# Altium schematic sheet I2C.SchDoc
size A4; CompanyName: TH Nürnberg; Organization: UltraZohm; Address1: Kesslerplatz 12; Address2: 90489 Nürnberg; Address3: GERMANY; SheetNumber: 9; SheetTotal: 10
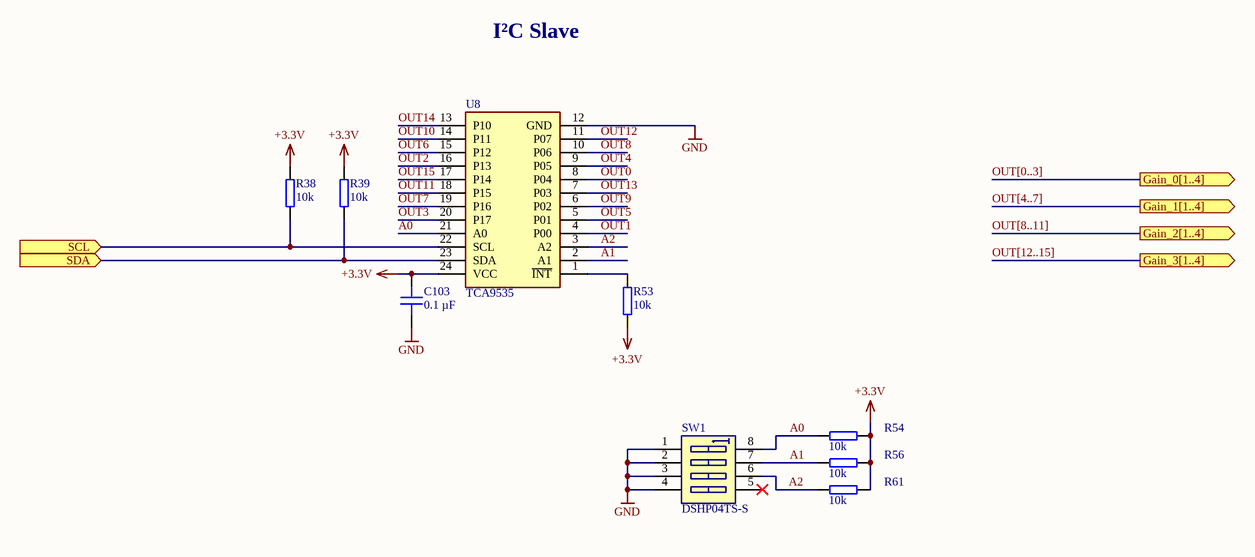
[diagram p0: I2C.SchDoc]

## Parts
C103  0.1 µF  [C_0603]
R38  10k  [RES 0603_1608]
R39  10k  [RES 0603_1608]
R53  10k  [RES 0603_1608]
R54  10k  [RES 0603_1608]
R56  10k  [RES 0603_1608]
R61  10k  [RES 0603_1608]
SW1  DSHP04TS-S  [416131160804]
U8  TCA9535  [SOP65P640X120-24N]

## Ports
Gain_0[1..4] (out), Gain_1[1..4] (out), Gain_2[1..4] (out), Gain_3[1..4] (out), SCL (in), SDA (in)

## Nets
+3.3V: C103.2 R38.2 R39.2 R53.1 R54.1 R56.1 R61.1 U8.24(VCC)
GND: C103.1 SW1.1 SW1.2 SW1.3 SW1.4 U8.12(GND)
A0: R54.2 SW1.8 U8.21(A0)
A1: R56.2 SW1.7 U8.2(A1)
A2: R61.2 SW1.6 U8.3(A2)
OUT0: U8.8(P04)
OUT1: U8.4(P00)
OUT2: U8.16(P13)
OUT3: U8.20(P17)
OUT4: U8.9(P05)
OUT5: U8.5(P01)
OUT6: U8.15(P12)
OUT7: U8.19(P16)
OUT8: U8.10(P06)
OUT9: U8.6(P02)
OUT10: U8.14(P11)
OUT11: U8.18(P15)
OUT12: U8.11(P07)
OUT13: U8.7(P03)
OUT14: U8.13(P10)
OUT15: U8.17(P14)
SCL: R38.1 U8.22(SCL) ; port SCL
SDA: R39.1 U8.23(SDA) ; port SDA
NetR53_2: R53.2 U8.1(~{INT})

Not connected (* = marked no-connect by the designer): SW1 5*

## Buses and harness runs
bus OUT[0..3] = port Gain_0[1..4]
bus OUT[4..7] = port Gain_1[1..4]
bus OUT[8..11] = port Gain_2[1..4]
bus OUT[12..15] = port Gain_3[1..4]

## Notes on the sheet
- I²C Slave
- Title
- Revision:
- Design Engineer:
- Date:
- Project:
- Sheet
- of

## Library data of the parts
C103 = C0603C104J3REC7411: Capacitor 0603, 25 VDC, 0.1 µF, X7R; Manufacturer: KEMET; Tolerance: 5 %; Voltage Rating: 25 VDC; Created from: MGremer; Manufacturer Part Number: C0603C104J3REC7411; PartID: 2; Created On: 20.12.2020 13:54:13; ComponentLink1Description: Datasheet; ComponentLink1URL: https://www.mouser.de/datasheet/2/212/1/KEM_C1090_X7R_ESD-1103328.pdf; Component Type: Capacitor 0603; Device Package: 0603; Last Updated: 20.12.2020 16:43:29; Mounting Type: SMD; Operating Temperature: -55 - 125°C; Series: ESD SMD Auto X7R; Supplier 1: Mouser; Supplier Part Number 1: 80-C0603C104J3RE7411; Type: Capacitor; Value: 0.1 µF; Live Cycle Status: 1; Stock number: Labor SMD Container
R38 R39 R53 R54 R56 R61 = RK73B1JTTD103J: SMD resistor E24 series; Manufacturer: KOA Speer; Tolerance: 5%; Created from: MGremer; Manufacturer Part Number: RK73B1JTTD103J; PartID: 98; Created On: 14.12.2020 16:17:14; ComponentLink1Description: Datasheet; ComponentLink1URL: https://www.mouser.de/datasheet/2/219/RK73B-1825463.pdf; Component Type: SMD resistor; Device Package: 0603; Last Updated: 02.03.2021 14:07:32; Mounting Type: SMD; Supplier 1: Mouser; Supplier Part Number 1: 660-RK73B1JTTD103J; Type: Resistor; Value: 10k; Live Cycle Status: 1; Stock number: Labor SMD Container
SW1 = DSHP04TS-S: 04p, 1.27mm Pitch, Horizontal, HP Type, SMT, flat Actuator, black, with Tape, T&R; Manufacturer: XKB Connectivity; Created from: T. Wendt; Manufacturer Part Number: DSHP04TS-S; PartID: 6; Created On: 02.03.2021 14:59:37; ComponentLink1Description: Datasheet; ComponentLink1URL: https://datasheet.lcsc.com/szlcsc/1912111437_XKB-Connectivity-DSHP04TS-S_C319050.pdf; Component Type: DIP-Switch; Device Package: DIP; Last Updated: 02.03.2021 14:59:37; Minimum Order: 1; Mounting Type: SMD; Supplier 1: LCSC; Supplier Part Number 1: C319050; Type: DIP-Switch; Live Cycle Status: 1; LCSC Part Number: C319050; Stock number: not stored
U8 = TCA9535: Low-Voltage 16-Bit I2C and SMBus Low-Power I/O Expander; Manufacturer_Name: Texas Instruments; Created from: PTurow; Datasheet Link: http://www.ti.com/lit/gpn/tca9535; Height: 1.2mm; Mouser2 Part Number: 595-TCA9535PWR; Mouser2 Price/Stock: https://www.mouser.com/Search/Refine.aspx?Keyword=595-TCA9535PWR; Manufacturer_Part_Number: TCA9535PWR; Manufacturer Part Number: TCA9535; PartID: 1; Created On: 20.05.2021 16:25:49; ComponentLink1Description: Datasheet; ComponentLink1URL: https://www.ti.com/lit/ds/symlink/tca9535.pdf?HQS=dis-mous-null-mousermode-dsf-pf-null-wwe&ts=1621337604488&ref_url=https%253A%252F%252Fwww.mouser.de%252F; Component Type: I2C-IO-Expander; Last Updated: 24.08.2021 11:10:15; Manufacturer: Texas Instruments; Mounting Type: SMD; Supplier 1: Mouser; Supplier Part Number 1: 595-TCA9535PWR; Type: I2C IO Expander; Live Cycle Status: 1; Stock number: not stored